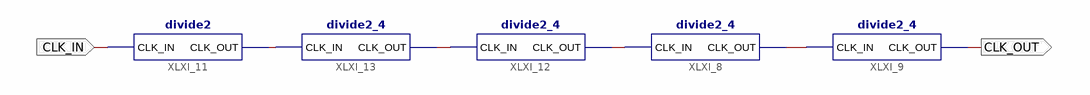
[diagram p0: schematic sheet 1]
// Xilinx ISE schematic divide2_16.sch (spartan6) as structural Verilog: 5 symbols, 2 ports
module divide2_16 (
  input  CLK_IN,
  output CLK_OUT
);

  wire XLXN_1, XLXN_2, XLXN_3, XLXN_8;

  divide2_4 XLXI_8 (.CLK_IN(XLXN_2), .CLK_OUT(XLXN_3));
  divide2_4 XLXI_9 (.CLK_IN(XLXN_3), .CLK_OUT(CLK_OUT));
  divide2 XLXI_11 (.CLK_IN(CLK_IN), .CLK_OUT(XLXN_1));
  divide2_4 XLXI_12 (.CLK_IN(XLXN_8), .CLK_OUT(XLXN_2));
  divide2_4 XLXI_13 (.CLK_IN(XLXN_1), .CLK_OUT(XLXN_8));
endmodule
